# Altium schematic sheet etna-sch-pmic.SchDoc
size A4; SheetNumber: 2; SheetTotal: 6; PageSetup: Record=PageOptions|CenterHorizontal=True|CenterVertical=True|PrintScale=0.73|XCorrection=1.00|YCorrection=1.00|PrintKind=1|BorderSize=5000000|LeftOffset=0|BottomOffset=0|Orientation=2|PaperLength=1000|PaperWidth=1000|Scale=100|PaperSource=15|PrintQuality=1200|MediaType=1|DitherType=10|PaperKind=A4|PrintScaleMode=1
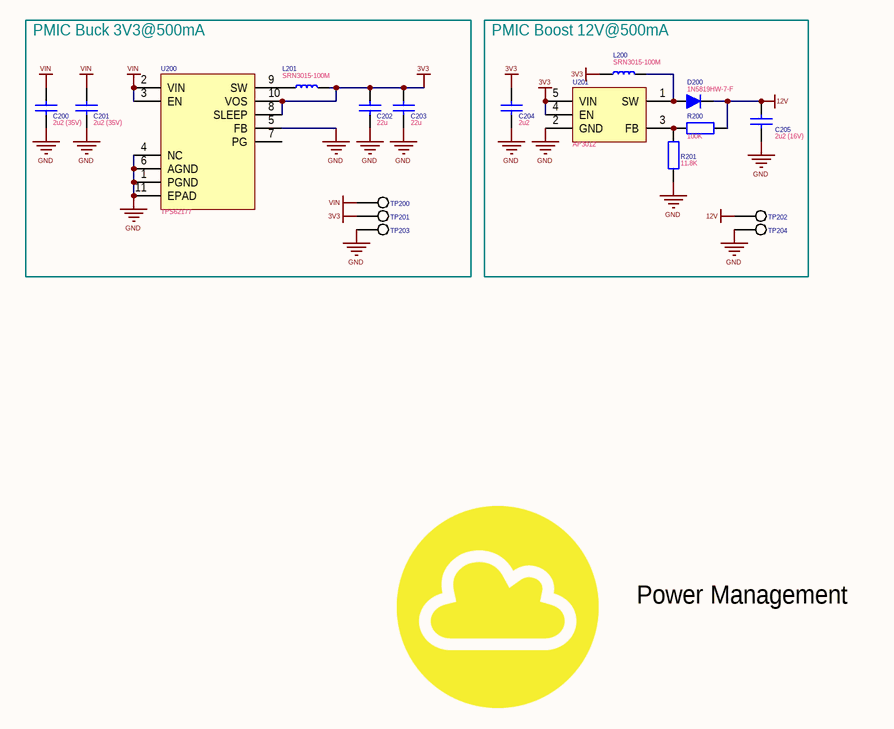
[diagram p0: etna-sch-pmic.SchDoc]

## Parts
C200  2u2 (35V)  [0805-CAP]
C201  2u2 (35V)  [0805-CAP]
C202  22u  [0805-CAP]
C203  22u  [0805-CAP]
C204  2u2  [0603-capacitor]
C205  2u2 (16V)  [0603-capacitor]
D200  1N5819HW-7-F  [SOD123-DIODE]
L200  SRN3015-100M  [SRN3015]
L201  SRN3015-100M  [SRN3015]
R200  100K  [0402-resistor]
R201  11.8K  [0402-resistor]
TP200  TP  [TESTPOINT]  (value not drawn)
TP201  TP  [TESTPOINT]  (value not drawn)
TP202  TP  [TESTPOINT]  (value not drawn)
TP203  TP  [TESTPOINT]  (value not drawn)
TP204  TP  [TESTPOINT]  (value not drawn)
U200  TPS62177  [WSON10]
U201  AP3012  [SOT-235]

## Blocks framed on the sheet
PMIC Buck 3V3@500mA: C200-C203 L201 TP200 TP201 TP203 U200
PMIC Boost 12V@500mA: C204 C205 D200 L200 R200 R201 TP202 TP204 U201

## Nets
3V3: C202.2 C203.2 C204.2 L200.1 L201.2 TP201.1(GND) U200.8(SLEEP) U200.10(VOS) U201.4(EN) U201.5(VIN)
12V: C205.2 D200.2(K) R200.2 TP202.1(GND)
GND: C200.1 C201.1 C202.1 C203.1 C204.1 C205.1 R201.2 TP203.1(GND) TP204.1(GND) U200.1(PGND) U200.4(NC) U200.5(FB) U200.6(AGND) U200.11(EPAD) U201.2(GND)
VIN: C200.2 C201.2 TP200.1(GND) U200.2(VIN) U200.3(EN)
NetD200_1: D200.1(A) L200.2 U201.1(SW)
NetL201_1: L201.1 U200.9(SW)
NetR200_1: R200.1 R201.1 U201.3(FB)

Not connected (* = marked no-connect by the designer): U200 7(PG)

## Notes on the sheet
- Power Management

## Library data of the parts
C200-C205 = CAP: Capacitor
D200 = DIODE: Published: 8-Jun-2000; LatestRevisionDate: 17-Jul-2002; LatestRevisionNote: Re-released for DXP Platform.; PackageVersion: Sep-1996; PackageReference: SMC; Publisher: Altium Limited; PackageDescription: DO-214-AB/SMC; 2 C-Bend Leads; Body 7.9 x 5.9 mm, inc. leads (LxW); Code_JEDEC: DO-214-AB
L200 L201 = IND: Inductor or Ferrite
R200 R201 = RES: Resistor
TP200-TP204 = TEST_POINT
U200 = TPS62175: TPS6217x 28-V, 0.5-A Step-Down Converter With Sleep Mode
U201 = AP3012: 1.5MHz STEP-UP DC-DC CONVERTER